# EAGLE schematic hes_wmu (EAGLE 8.2.2)
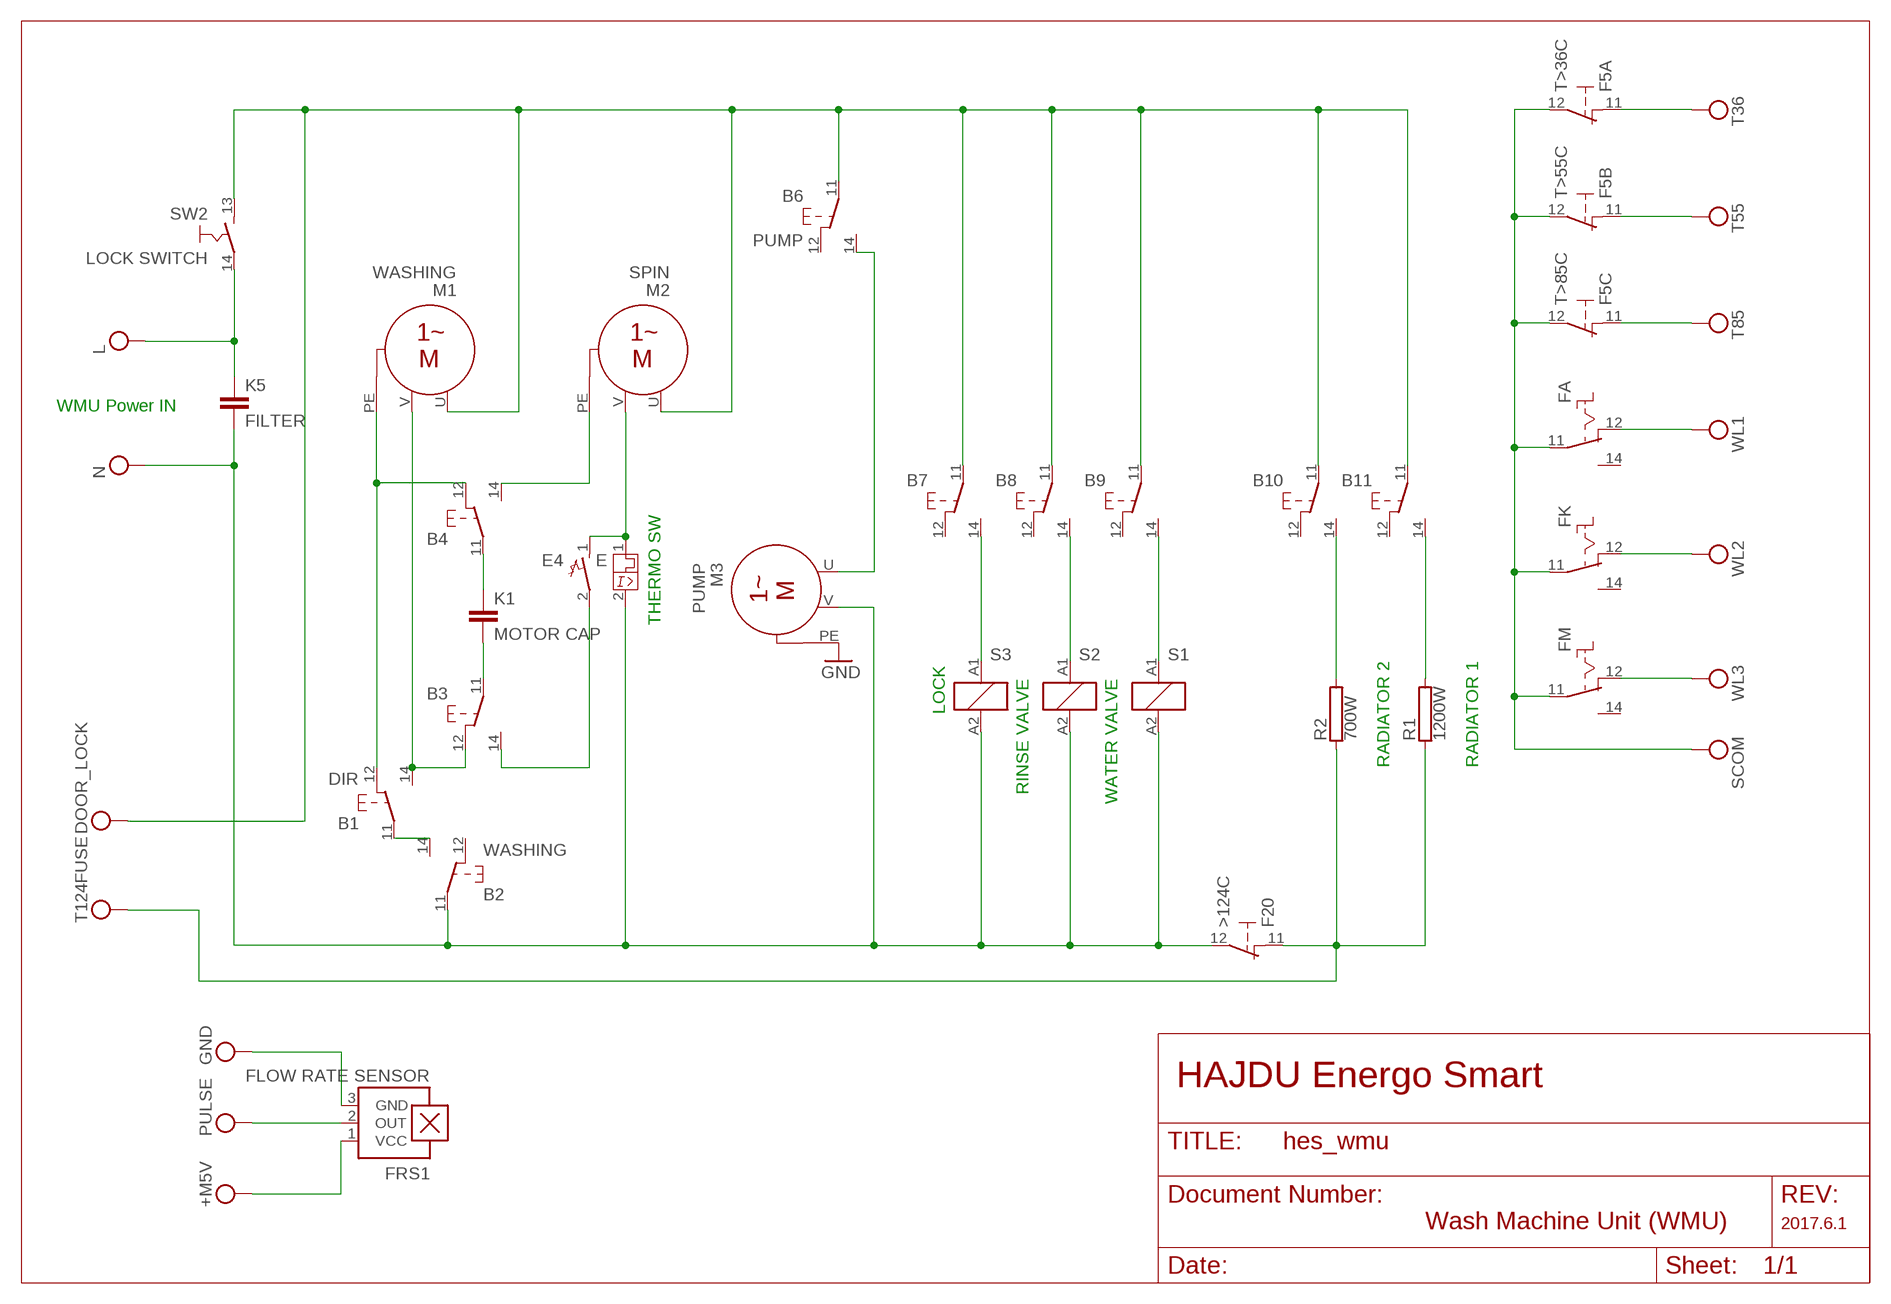
[diagram p0: schematic, sheet 1]

## Parts
B1  DIR  DRUCK-WECHSELSCHALTER  [DRUCK-WECHSELSCHALTER]
B2  WASHING  DRUCK-WECHSELSCHALTER  [DRUCK-WECHSELSCHALTER]
B3  DRUCK-WECHSELSCHALTER  [DRUCK-WECHSELSCHALTER]
B4  DRUCK-WECHSELSCHALTER  [DRUCK-WECHSELSCHALTER]
B6  PUMP  DRUCK-WECHSELSCHALTER  [DRUCK-WECHSELSCHALTER]
B7  DRUCK-WECHSELSCHALTER  [DRUCK-WECHSELSCHALTER]
B8  DRUCK-WECHSELSCHALTER  [DRUCK-WECHSELSCHALTER]
B9  DRUCK-WECHSELSCHALTER  [DRUCK-WECHSELSCHALTER]
B10  DRUCK-WECHSELSCHALTER  [DRUCK-WECHSELSCHALTER]
B11  DRUCK-WECHSELSCHALTER  [DRUCK-WECHSELSCHALTER]
E  MOTORSCHUTZSCHALTER_1-POL_THERM_MAG_AUSLOESUNG_ALTERNATIV  [MOTORSCHUTZSCHALTER_1-POL_THERM_MAG_AUSLOESUNG]
E4  MOTORSCHUTZSCHALTER_1-POL_THERM_AUSLOESUNG  [MOTORSCHUTZSCHALTER_1-POL_THERM_AUSLOESUNG]
F5A  T>36C  SCHALTER_OEFFNER_HANDBETAETIGT  [SCHALTER_OEFFNER]
F5B  T>55C  SCHALTER_OEFFNER_HANDBETAETIGT  [SCHALTER_OEFFNER]
F5C  T>85C  SCHALTER_OEFFNER_HANDBETAETIGT  [SCHALTER_OEFFNER]
F20  >124C  SCHALTER_OEFFNER_HANDBETAETIGT  [SCHALTER_OEFFNER]
FA  DREH-WECHSELSCHALTER  [DREH-WECHSELSCHALTER]
FK  DREH-WECHSELSCHALTER  [DREH-WECHSELSCHALTER]
FM  DREH-WECHSELSCHALTER  [DREH-WECHSELSCHALTER]
FRS1  FLOW RATE SENSOR  A1301LH  [SOT23-W]
K1  MOTOR CAP  C37/20  [C37.5B20]
K5  FILTER  C-EU375-203X418  [C375-203X418]
M1  WASHING  MOTOR_1-PHASEN  [MOTOR_1-PHASEN]
M2  SPIN  MOTOR_1-PHASEN  [MOTOR_1-PHASEN]
M3  PUMP  MOTOR_1-PHASEN  [MOTOR_1-PHASEN]
R1  1200W  RAC01  [AC01]
R2  700W  RAC01  [AC01]
S1  Mágnesszelep  ZNS5106  [ZN5]
S2  Beöblítő  ZNS5106  [ZN5]
S3  Lock  ZNS5106  [ZN5]
SW2  LOCK SWITCH  SCHLIESSER_RASTSCHALTER  [SCHLIESSER_RASTSCHALTER]

## Nets
GND: M3.PE
N$4: B4.14 M2.PE
N$5: B1.12 B4.12 M1.PE
N$6: B4.11 K1.1
N$7: B3.11 K1.2
N$8: B1.14 B3.12 M1.V
N$9: B1.11 B2.14
N$11: B10.14 R2.2
N$12: E4.1 E.1 M2.V
N$13: B3.14 E4.2
N$14: B6.14 M3.U
N$15: B11.14 R1.2
N$16: B7.14 S3.A1
N$17: B8.14 S2.A1
N$18: B9.14 S1.A1
VCC: B2.11 B6.11 B7.11 B8.11 B9.11 B10.11 B11.11 E.2 F5A.11 F5A.12 F5B.11 F5B.12 F5C.11 F5C.12 F20.11 F20.12 FA.11 FA.12 FK.11 FK.12 FM.11 FM.12 FRS1.1(VCC) FRS1.2(OUT) FRS1.3(GND) K5.1 K5.2 M1.U M2.U M3.V R1.1 R2.1 S1.A2 S2.A2 S3.A2 SW2.13 SW2.14 ; supply symbol labelled T36, T55, T85, WL1, WL2, WL3, L, SCOM, PULSE, +M5V, N, GND, DOOR_LOCK, T124FUSE
Unconnected: B2.12 B6.12 B7.12 B8.12 B9.12 B10.12 B11.12 FA.14 FK.14 FM.14 S1.11(2:P) S1.12(2:O) S1.14(2:S) S2.11(2:P) S2.12(2:O) S2.14(2:S) S3.11(2:P) S3.12(2:O) S3.14(2:S)

## Notes on the sheet
- WMU Power IN
- THERMO SW
- RINSE VALVE | WATER VALVE
- LOCK
- RADIATOR 2 | RADIATOR 1
- HAJDU Energo Smart
- Wash Machine Unit (WMU) | 2017.6.1

## Library data of the parts
B1-B4 B6-B11 = e-schalter:DRUCK-WECHSELSCHALTER: Druckschalter, Wechsler
E = e-motorschutzschalter:MOTORSCHUTZSCHALTER_1-POL_THERM_MAG_AUSLOESUNG_ALTERNATIV: Motorschutzschalter 1-pol mit thermischer und magnetischer Auslösung (alternativ)
E4 = e-motorschutzschalter:MOTORSCHUTZSCHALTER_1-POL_THERM_AUSLOESUNG: Motorschutzschalter 1-pol. mit thermischer Auslösung
F5A F5B F5C F20 = e-schalter:SCHALTER_OEFFNER_HANDBETAETIGT: Öffner allgemein
FA FK FM = e-schalter:DREH-WECHSELSCHALTER: Drehwechselschalter
FRS1 = allegro:A13*?: Linear Hall Effect Sensor ICs Continuous-Time Ratiometric High-Temperature Operation Programmable Linear with Analog Output A1302 -Replacement- UGN3503 Source: http://www.allegromicro.com/en/Products/Part_Numbers/1301/1301.pdf http://www.allegromicro.com/en/Products/Part_Numbers/1321/1321.pdf http://www.allegromicro.com/en/Products/Part_Numbers/1381/1381.pdf; MF: ALLEGRO MICROSYSTEMS, INC.; MPN: A1301ELHLT-T; OC_FARNELL: 1198084; OC_NEWARK: 31K6634
K1 = capacitor-wima:C: CAPACITOR naming: grid - package width
K5 = resistor:C-EU: CAPACITOR, European symbol
M1-M3 = e-motoren:MOTOR_1-PHASEN: 1-Phasen-Wechselstrom-Motor
R1 R2 = resistor-power:R: Power Resitor; OC_FARNELL: unknown; OC_NEWARK: unknown
S1-S3 = relay:ZNS5*: Miniature Power PCB Relay SCHRACK 1pole 10 A Source: http://www.schrack.com/.. 5847.pdf; OC_FARNELL: unknown; OC_NEWARK: unknown
SW2 = e-schalter:SCHLIESSER_RASTSCHALTER: Rastschalter, Schließer